# Altium schematic sheet [0] Sheet1.SchDoc
size A4; Organization: Altium Limited; Address1: L3, 12a Rodborough Rd; Address2: Frenchs Forest; Address3: NSW; Address4: Australia 2086
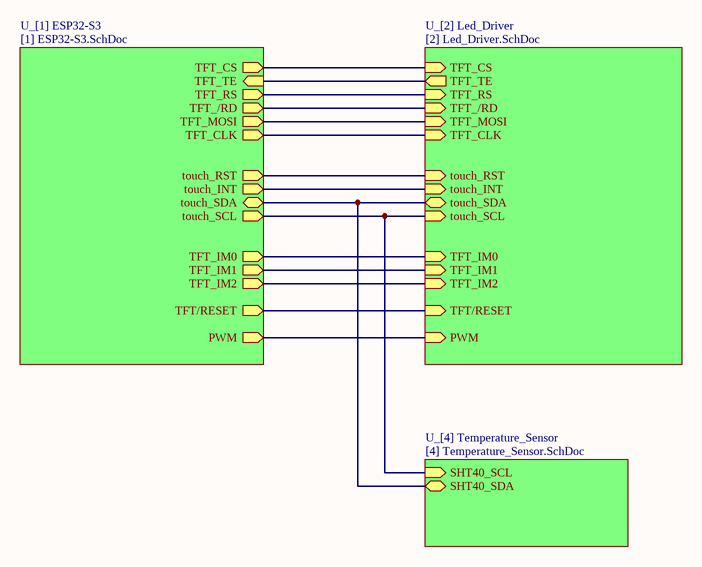
[diagram p0: [0] Sheet1.SchDoc]

## Sub-sheets
U_[1] ESP32-S3 = [1] ESP32-S3.SchDoc: TFT_CLK (out), TFT_CS (out), TFT_MOSI (out), touch_SCL (out), TFT_IM0 (out), TFT_IM1 (out), TFT_IM2 (out), touch_INT (out), TFT_TE (in), TFT_RS (out), TFT_/RD (out), TFT/RESET (out), touch_RST (out), PWM (out), touch_SDA (bidir)
U_[2] Led_Driver = [2] Led_Driver.SchDoc: PWM (in), TFT_TE (out), TFT_RS (in), TFT_/RD (in), TFT_IM0 (in), TFT_IM1 (in), TFT_IM2 (in), TFT/RESET (in), TFT_CLK (in), TFT_CS (in), TFT_MOSI (in), touch_INT (in), touch_RST (in), touch_SCL (in), touch_SDA (bidir)
U_[4] Temperature_Sensor = [4] Temperature_Sensor.SchDoc: SHT40_SCL (in), SHT40_SDA (bidir)

## Nets
(unnamed): sheet U_[1] ESP32-S3/TFT_CLK, sheet U_[2] Led_Driver/TFT_CLK
(unnamed): sheet U_[1] ESP32-S3/TFT_CS, sheet U_[2] Led_Driver/TFT_CS
(unnamed): sheet U_[1] ESP32-S3/TFT_MOSI, sheet U_[2] Led_Driver/TFT_MOSI
(unnamed): sheet U_[1] ESP32-S3/touch_SCL, sheet U_[2] Led_Driver/touch_SCL, sheet U_[4] Temperature_Sensor/SHT40_SCL
(unnamed): sheet U_[1] ESP32-S3/TFT_IM0, sheet U_[2] Led_Driver/TFT_IM0
(unnamed): sheet U_[1] ESP32-S3/TFT_IM1, sheet U_[2] Led_Driver/TFT_IM1
(unnamed): sheet U_[1] ESP32-S3/TFT_IM2, sheet U_[2] Led_Driver/TFT_IM2
(unnamed): sheet U_[1] ESP32-S3/touch_INT, sheet U_[2] Led_Driver/touch_INT
(unnamed): sheet U_[1] ESP32-S3/TFT_TE, sheet U_[2] Led_Driver/TFT_TE
(unnamed): sheet U_[1] ESP32-S3/TFT_RS, sheet U_[2] Led_Driver/TFT_RS
(unnamed): sheet U_[1] ESP32-S3/TFT_/RD, sheet U_[2] Led_Driver/TFT_/RD
(unnamed): sheet U_[1] ESP32-S3/TFT/RESET, sheet U_[2] Led_Driver/TFT/RESET
(unnamed): sheet U_[1] ESP32-S3/touch_RST, sheet U_[2] Led_Driver/touch_RST
(unnamed): sheet U_[1] ESP32-S3/PWM, sheet U_[2] Led_Driver/PWM
(unnamed): sheet U_[1] ESP32-S3/touch_SDA, sheet U_[2] Led_Driver/touch_SDA, sheet U_[4] Temperature_Sensor/SHT40_SDA

## Notes on the sheet
- Title
- Size:
- Date:
- A4
- Number:
- Time:
- Revision:
- Sheet
- of
- File: